# EAGLE design untitled (EAGLE 6.3)
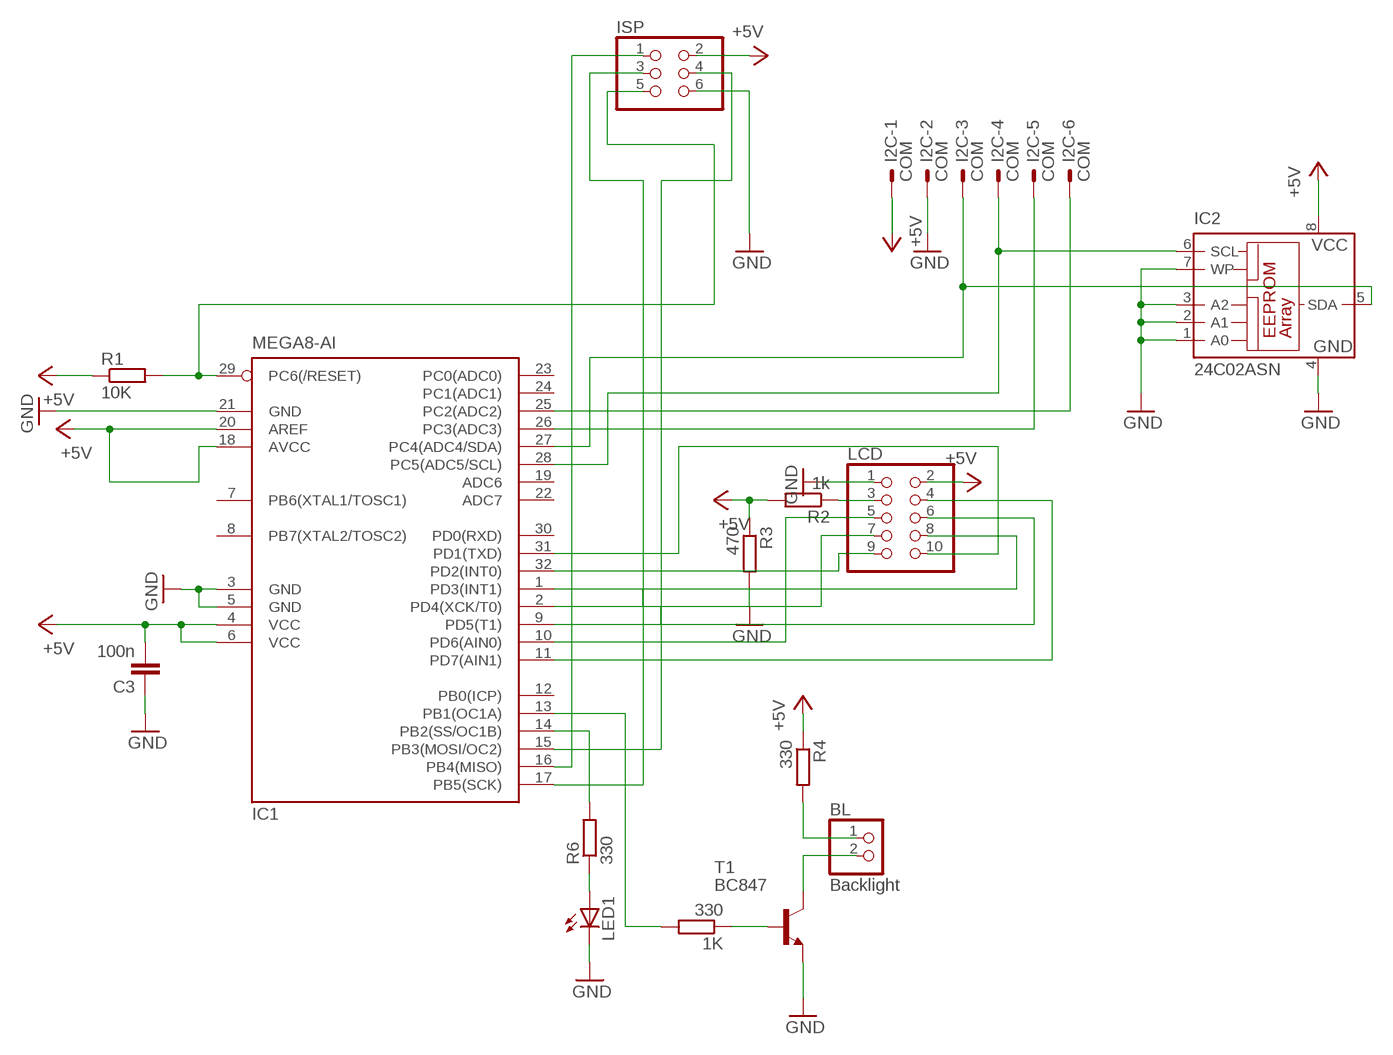
[diagram p0: schematic, sheet 1]

## Parts
1K  330  R-EU_M0805  [M0805]
BL  Backlight  PINHD-1X2  [1X02]
C3  100n  C-EUC0805  [C0805]
I2C  COM  ML6E  [ML6]
IC1  MEGA8-AI  [TQFP32-08]
IC2  24C02ASN  [SO-08]
ISP  PINHD-2X3  [2X03]
LCD  PINHD-2X5  [2X05]
LED1  LEDCHIP-LED0805  [CHIP-LED0805]
R1  10K  R-EU_M0805  [M0805]
R2  1k  R-EU_M0805  [M0805]
R3  470  R-EU_M0805  [M0805]
R4  330  R-EU_M0805  [M0805]
R6  330  R-EU_M0805  [M0805]
T1  BC847  [SOT23]

## Nets
+5V: C3.2 I2C.1 IC1.4(VCC) IC1.6(VCC) IC1.18(AVCC) IC1.20(AREF) IC2.8(VCC) ISP.2 LCD.2 R1.1 R2.2 R3.1 R4.1
GND: C3.1 I2C.2 IC1.3(GND) IC1.5(GND) IC1.21(GND) IC2.1(A0) IC2.2(A1) IC2.3(A2) IC2.4(GND) IC2.7(WP) ISP.6 LCD.1 LED1.C R3.2 T1.2(E)
N$2: LCD.3 R2.1
N$3: IC1.11(PD7(AIN1)) LCD.4
N$4: IC1.10(PD6(AIN0)) LCD.5
N$5: IC1.9(PD5(T1)) LCD.6
N$6: IC1.2(PD4(XCK/T0)) LCD.7
N$7: IC1.1(PD3(INT1)) LCD.8
N$8: IC1.32(PD2(INT0)) LCD.9
N$10: IC1.31(PD1(TXD)) LCD.10
N$11: BL.1 R4.2
N$12: BL.2 T1.3(C)
N$13: 1K.1 T1.1(B)
N$15: 1K.2 IC1.13(PB1(OC1A))
N$16: I2C.3 IC1.27(PC4(ADC4/SDA)) IC2.5(SDA)
N$17: IC1.14(PB2(SS/OC1B)) R6.2
N$18: I2C.4 IC1.28(PC5(ADC5/SCL)) IC2.6(SCL)
N$19: I2C.5 IC1.26(PC3(ADC3))
N$20: IC1.15(PB3(MOSI/OC2)) ISP.4
N$21: IC1.16(PB4(MISO)) ISP.1
N$22: IC1.17(PB5(SCK)) ISP.3
N$23: I2C.6 IC1.25(PC2(ADC2))
N$28: IC1.29(PC6(/RESET)) ISP.5 R1.2
N$34: LED1.A R6.1
Unconnected: IC1.7(PB6(XTAL1/TOSC1)) IC1.8(PB7(XTAL2/TOSC2)) IC1.12(PB0(ICP)) IC1.19(ADC6) IC1.22(ADC7) IC1.23(PC0(ADC0)) IC1.24(PC1(ADC1)) IC1.30(PD0(RXD))

## Library data of the parts
1K R1-R4 R6 = rcl:R-EU_: RESISTOR, European symbol
BL = pinhead:PINHD-1X2: PIN HEADER
C3 = rcl:C-EU: CAPACITOR, European symbol
I2C = con-harting-ml:ML6?E: HARTING
IC1 = atmel:MEGA8: MICROCONTROLLER 8 Kbytes FLASH, 1 kbytes SRAM, 512 bytes EEPROM, USART, 6-channel 10 bit ADC, 2-channel 8 bit ADC Pin compatible with Atmega48, ATMega88, ATMega168 Source: avr.lbr
IC2 = microchip:24C*: Serial EEPROM 1 K/2 K/4 K
ISP = pinhead:PINHD-2X3: PIN HEADER
LCD = pinhead:PINHD-2X5: PIN HEADER
LED1 = led:LED: LED OSRAM: - CHIPLED LG R971, LG N971, LY N971, LG Q971, LY Q971, LO R971, LY R971 LH N974, LH R974 LS Q976, LO Q976, LY Q976 LO Q996 - Hyper CHIPLED LW Q18S LB Q993, LB Q99A, LB R99A - SideLED LS A670, LO A670, LY A670, LG A670, LP A670 LB A673, LV A673, LT A673, LW A673 LH A674 LY A675 LS A676, LA A676, LO A676, LY A676, LW A676 LS A679, LY A679, LG A679 - Hyper Micro SIDELED® LS Y876, LA Y876, LO Y876, LY Y876 LT Y87S - SmartLED LW L88C, LW L88S LB L89C, LB L89S, LG L890 LS L89K, LO L89K, LY L89K LS L896, LA L896, LO L896, LY L896 - TOPLED LS T670, LO T670, LY T670, LG T670, LP T670 LSG T670, LSP T670, LSY T670, LOP T670, LYG T670 LG T671, LOG T671, LSG T671 LB T673, LV T673, LT T673, LW T673 LH T674 LS T676, LA T676, LO T676, LY T676, LB T676, LH T676, LSB T676, LW T676 LB T67C, LV T67C, LT T67C, LS T67K, LO T67K, LY T67K, LW E67C LS E67B, LA E67B, LO E67B, LY E67B, LB E67C, LV E67C, LT E67C LW T67C LS T679, LY T679, LG T679 LS T770, LO T770, LY T770, LG T770, LP T770 LB T773, LV T773, LT T773, LW T773 LH T774 LS E675, LA E675, LY E675, LS T675 LS T776, LA T776, LO T776, LY T776, LB T776 LHGB T686 LT T68C, LB T68C - Hyper Mini TOPLED® LB M676 - Mini TOPLED Santana® LG M470 LS M47K, LO M47K, LY M47K Source: http://www.osram.convergy.de LUXEON: - LUMILED® LXK2-PW12-R00, LXK2-PW12-S00, LXK2-PW14-U00, LXK2-PW14-V00 LXK2-PM12-R00, LXK2-PM12-S00, LXK2-PM14-U00 LXK2-PE12-Q00, LXK2-PE12-R00, LXK2-PE12-S00, LXK2-PE14-T00, LXK2-PE14-U00 LXK2-PB12-K00, LXK2-PB12-L00, LXK2-PB12-M00, LXK2-PB14-N00, LXK2-PB14-P00, LXK2-PB14-Q00 LXK2-PR12-L00, LXK2-PR12-M00, LXK2-PR14-Q00, LXK2-PR14-R00 LXK2-PD12-Q00, LXK2-PD12-R00, LXK2-PD12-S00 LXK2-PH12-R00, LXK2-PH12-S00 LXK2-PL12-P00, LXK2-PL12-Q00, LXK2-PL12-R00 Source: www.luxeon.com KINGBRIGHT: KA-3528ASYC Source: www.kingbright.com
T1 = transistor:BC847: NPN TRANSISTOR

## Board
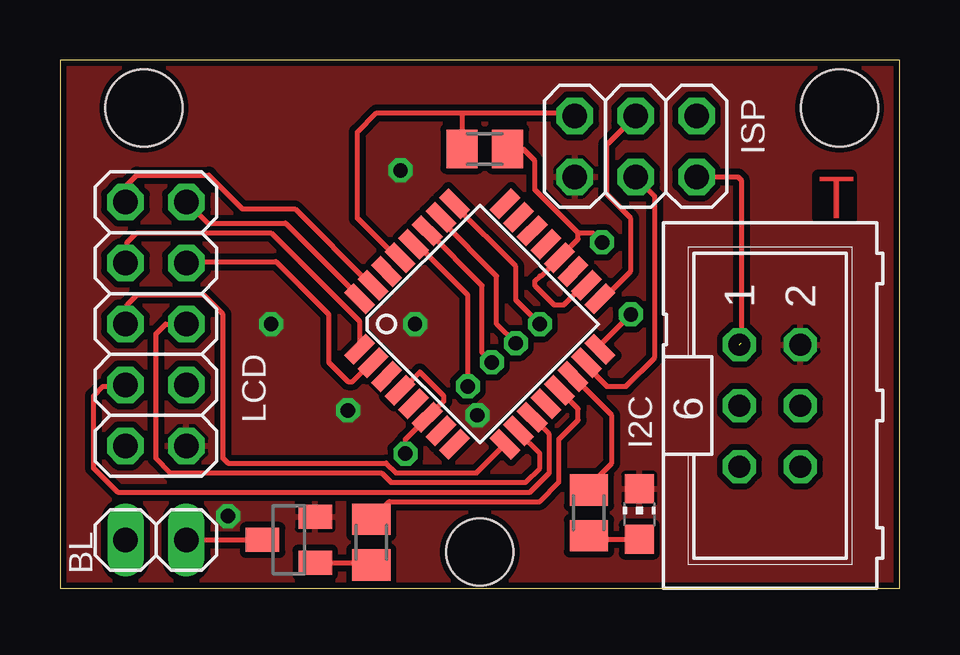
[diagram p1: board, top side]
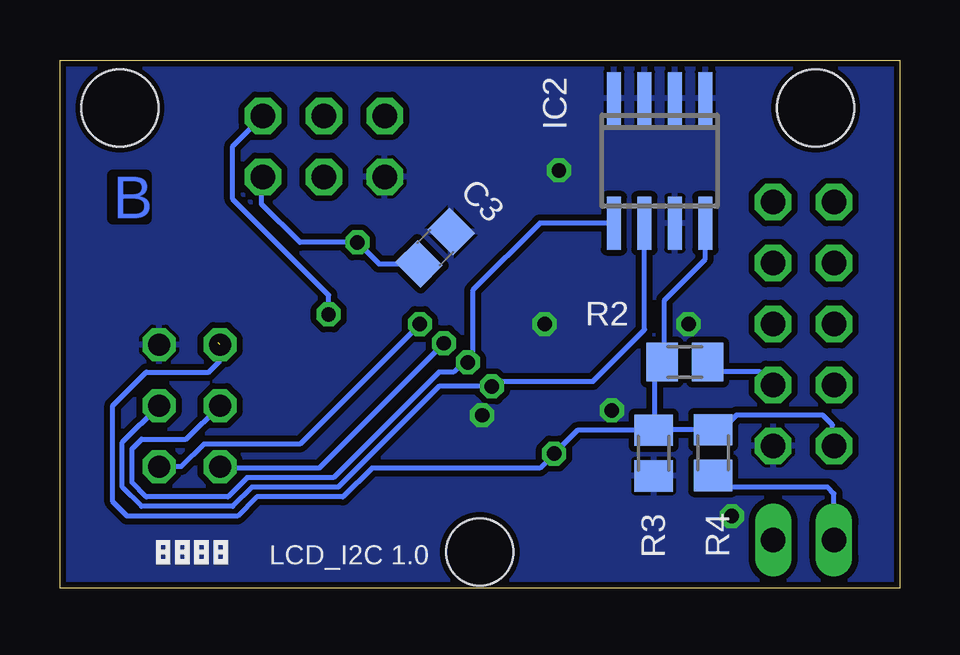
[diagram p2: board, bottom side, seen from below]

Size 35 x 22 mm. Coordinates in mm from the lower left corner, seen from the top.
Outline: 0,0 35,0 35,22 0,22 0,0
Copper layers (1*16): Top 0.035mm / dielectric 1.5mm / Bottom 0.035mm
Design rules "platinensammler_02": minimum track width 0.15mm, minimum drill 0.3mm, track to track 0.15mm, track to pad 0.15mm, pad to pad 0.15mm, via to via 0.15mm, smd to smd 0mil, copper to edge 0.2mm, drill to drill 0.2mm, minimum pad ring 0.2mm, minimum via ring 0.2mm, stop-mask expansion 4mil, vias tented up to drill 0.8mm, thermal gap 0.15mm
Holes 3.2 mm at 3.5,20 32.5,20
Holes 2.8 mm at 17.5,1.5

### Footprints (pad centres in the part's own frame; a part is rotated, then mirrored left to right if it is on the bottom)
M0805 = smd 1.3 x 1.6: 1 -0.95,0; 2 0.95,0
1X02 = drill 1.016 long: 1 -1.27,0; 2 1.27,0
C0805 = smd 1.3 x 1.5: 1 -0.95,0; 2 0.95,0
ML6 = drill 0.914 octagon: 1 -2.54,-1.27; 2 -2.54,1.27; 3 0,-1.27; 4 0,1.27; 5 2.54,-1.27; 6 2.54,1.27
TQFP32-08 = smd 1.27 x 0.559: 1 -4.293,2.8; 2 -4.293,2; 3 -4.293,1.2; 4 -4.293,0.4; 5 -4.293,-0.4; 6 -4.293,-1.2; 7 -4.293,-2; 8 -4.293,-2.8; 17 4.293,-2.8; 18 4.293,-2; 19 4.293,-1.2; 20 4.293,-0.4; 21 4.293,0.4; 22 4.293,1.2; 23 4.293,2; 24 4.293,2.8 | smd 0.559 x 1.27: 9 -2.8,-4.293; 10 -2,-4.293; 11 -1.2,-4.293; 12 -0.4,-4.293; 13 0.4,-4.293; 14 1.2,-4.293; 15 2,-4.293; 16 2.8,-4.293; 25 2.8,4.293; 26 2,4.293; 27 1.2,4.293; 28 0.4,4.293; 29 -0.4,4.293; 30 -1.2,4.293; 31 -2,4.293; 32 -2.8,4.293
SO-08 = smd 0.6 x 2.2: 1 -1.905,-2.6; 2 -0.635,-2.6; 3 0.635,-2.6; 4 1.905,-2.6; 5 1.905,2.6; 6 0.635,2.6; 7 -0.635,2.6; 8 -1.905,2.6
2X03 = drill 1.016 octagon: 1 -2.54,-1.27; 2 -2.54,1.27; 3 0,-1.27; 4 0,1.27; 5 2.54,-1.27; 6 2.54,1.27
2X05 = drill 1.016 octagon: 1 -5.08,-1.27; 2 -5.08,1.27; 3 -2.54,-1.27; 4 -2.54,1.27; 5 0,-1.27; 6 0,1.27; 7 2.54,-1.27; 8 2.54,1.27; 9 5.08,-1.27; 10 5.08,1.27
CHIP-LED0805 = smd 1.2 x 1.2: A 0,-1.05; C 0,1.05
SOT23 = smd 1 x 1.4: 1 -0.95,-1.1; 2 0.95,-1.1; 3 0,1.1

### Placement (x,y rotation side)
1K  12.98,1.91 90 top
BL  4,2 0 top
C3  19.36,14.18 225 bottom
I2C  29.6,7.6 270 top
IC1  17.5,11 45 top
IC2  10,17.8 180 bottom
ISP  24,18.4 180 top
LCD  4,11 90 top
LED1  24.15,3.08 0 top
R1  17.71,18.3 180 top
R2  8.95,9.41 180 bottom
R3  10.25,5.62 270 bottom
R4  7.77,5.64 270 bottom
R6  22.05,3.13 90 top
T1  9.54,2.01 90 top
U$1  [LP_NUMBER_SILK_BOT]  27.8,0.8 0 top

### Tracks (layer width: path | path; a pad name or v marks a point on that pad's centre or on a via)
+5V  (via drill 0.6)  (1 unrouted)
  Top 0.2: IC1.18 21.82,12.62 21,11.8 20.6,11.8 19.8,12.6 19.8,12.8 20,13 20.07,13 IC1.20 21.6,14.53 21.6,14.8 | ISP.2 28.27,17.13 28.4,17 28.4,10.21 | R1.1 19.3,18.3 19.8,17.8 19.8,16.6 21.6,14.8 | IC1.4 14.25,8.25 15,9 16,8 16,7.8 | 16,7.8 IC1.6 14.4,6.2 | 21.6,14.8 22.2,14.8 v22.6,14.4 | 16,7.8 14.4,6.2 | v14.4,5.6 14.4,6.2
  Bottom 0.2: LCD.2 2.8,5.99 2.8,6.8 3.2,7.2 6.8,7.2 7.41,6.59 R4.1 10.23,6.59 R3.1 | I2C.1 28.33,9.47 28.8,9 31.4,9 32.8,7.6 32.8,3.6 32.2,3 27.6,3 26.8,3.8 23.2,3.8 22,5 15,5 v14.4,5.6 13.43,6.57 R3.1 | ISP.2 26.6,17.07 26.6,16 25,14.4 v22.6,14.4 21.71,13.51 C3.2 | R3.1 10.2,6.62 10.2,8.8 9.9,9.1 R2.2 9.8,9.51 9.8,12 8.1,13.71 IC2.8
GND  (via drill 0.6)
  other vias: 7,3 14.8,11 8.8,11 14.2,17.4 17.4,7.2 12,7.4
  pour Top (isolate 0.254): 0,22 35,22 35,0 0,0
  pour Bottom (isolate 0.254): 0,22 35,22 35,0 0,0
N$2
  Bottom 0.2: 5.42,8.61 LCD.3 5.82,9.01 7.6,9.01 R2.1
N$3
  Top 0.2: IC1.11 20.4,6.4 20.4,4.8 19.6,4 2.4,4 1.4,5 1.4,8 1.8,8.4 2.67,8.4 LCD.4
N$4
  Top 0.2: IC1.10 19.12,6.48 20,5.6 20,5 19.4,4.4 13.8,4.4 13.4,4.8 4.6,4.8 4,5.4 4,10.6 4.4,11 LCD.5
N$5
  Top 0.2: LCD.6 2.8,11.07 2.8,11.8 3.2,12.2 6,12.2 6.8,11.4 6.8,5.4 7,5.2 13.6,5.2 14,4.8 17.37,4.8 IC1.9
N$6
  Top 0.2: IC1.2 12.98,9.38 12.2,8.6 12,8.6 11.2,9.4 11.2,11.4 9,13.6 5.33,13.6 LCD.7
N$7
  Top 0.2: IC1.1 12.48,11.12 8.8,14.8 3.2,14.8 2.8,14.4 2.8,13.61 LCD.8
N$8
  Top 0.2: IC1.32 12.48,12.12 9.4,15.2 6.15,15.2 LCD.9
N$10
  Top 0.2: IC1.31 12.98,12.62 9.8,15.8 7.6,15.8 6.2,17.2 3.2,17.2 2.8,16.8 2.8,16.15 LCD.10
N$11
  Bottom 0.2: BL.1 2.73,3.93 3,4.2 7.48,4.2 R4.2
N$12
  Top 0.2: T1.3 BL.2
N$13
  Top 0.2: T1.1 12.88,1.06 1K.1
N$15
  Top 0.2: IC1.13 21.6,7.47 21.6,7 20.8,6.2 20.8,4.4 20,3.6 13.72,3.6 1K.2
N$16  (via drill 0.6)
  Top 0.2: IC1.27 17.6,12.6 17.6,9.8 v18,9.4
  Bottom 0.2: I2C.3 29.73,6.2 31.6,6.2 32,5.8 32,4.4 31.4,3.8 28,3.8 27.2,4.6 23.6,4.6 19.2,9 18.6,9 18.2,9.4 v18,9.4 17.8,9.6 17.8,12.4 15,15.2 IC2.5
N$17
  Top 0.2: R6.2 21.88,4.08 23,5.2 23,7.2 IC1.14
N$18  (via drill 0.6)
  Top 0.2: IC1.28 14.88,14.32 17,12.2 v17,8.4
  Bottom 0.2: I2C.4 32.4,6.07 32.4,4.2 31.6,3.4 27.8,3.4 27,4.2 23.4,4.2 19.2,8.4 v17,8.4 16.8,8.6 12.8,8.6 10.63,10.77 IC2.6
N$19  (via drill 0.6)
  Top 0.2: IC1.26 15.88,15.32 18.2,13 18.2,11 v19,10.2
  Bottom 0.2: I2C.5 28.27,5 24.2,5 v19,10.2
N$20
  Top 0.2: IC1.15 21.95,9.25 22.8,8.4 23.6,8.4 24.8,9.6 24.8,16.33 ISP.4
N$21  (via drill 0.6)
  Top 0.2: IC1.16 22.52,10.12 v23.8,11.4
  Bottom 0.2: v23.8,11.4 23.8,12.2 27.8,16.2 27.8,18.41 ISP.1
N$22
  Top 0.2: IC1.17 22.66,12.05 23.8,13.2 23.8,15.4 22.8,16.4 22.8,18.47 ISP.3
N$23  (via drill 0.6)
  Top 0.2: IC1.25 16.45,15.96 19,13.4 19,12 v20,11
  Bottom 0.2: 31.01,5.2 I2C.6 29.94,5.06 29,6 25,6 v20,11
N$24
  pour Bottom (isolate 0.254): 0,22 35,22 35,0 0,0
N$25
  pour Top (isolate 0.254): 0,22 35,22 35,0 0,0
N$28
  Top 0.2: IC1.29 14.05,13.75 12.4,15.4 12.4,19 13.2,19.8 16.8,19.8 | 16.8,19.8 21.33,19.8 ISP.5 | R1.2 16.76,19.76 16.8,19.8
N$34
  Top 0.2: LED1.A 22,2.03 R6.1

### Text on the board
Top: T
Bottom: B
bNames: LCD_I2C 1.0